# EAGLE design SFT_LIFTUP1.0V (EAGLE 7.5.0)
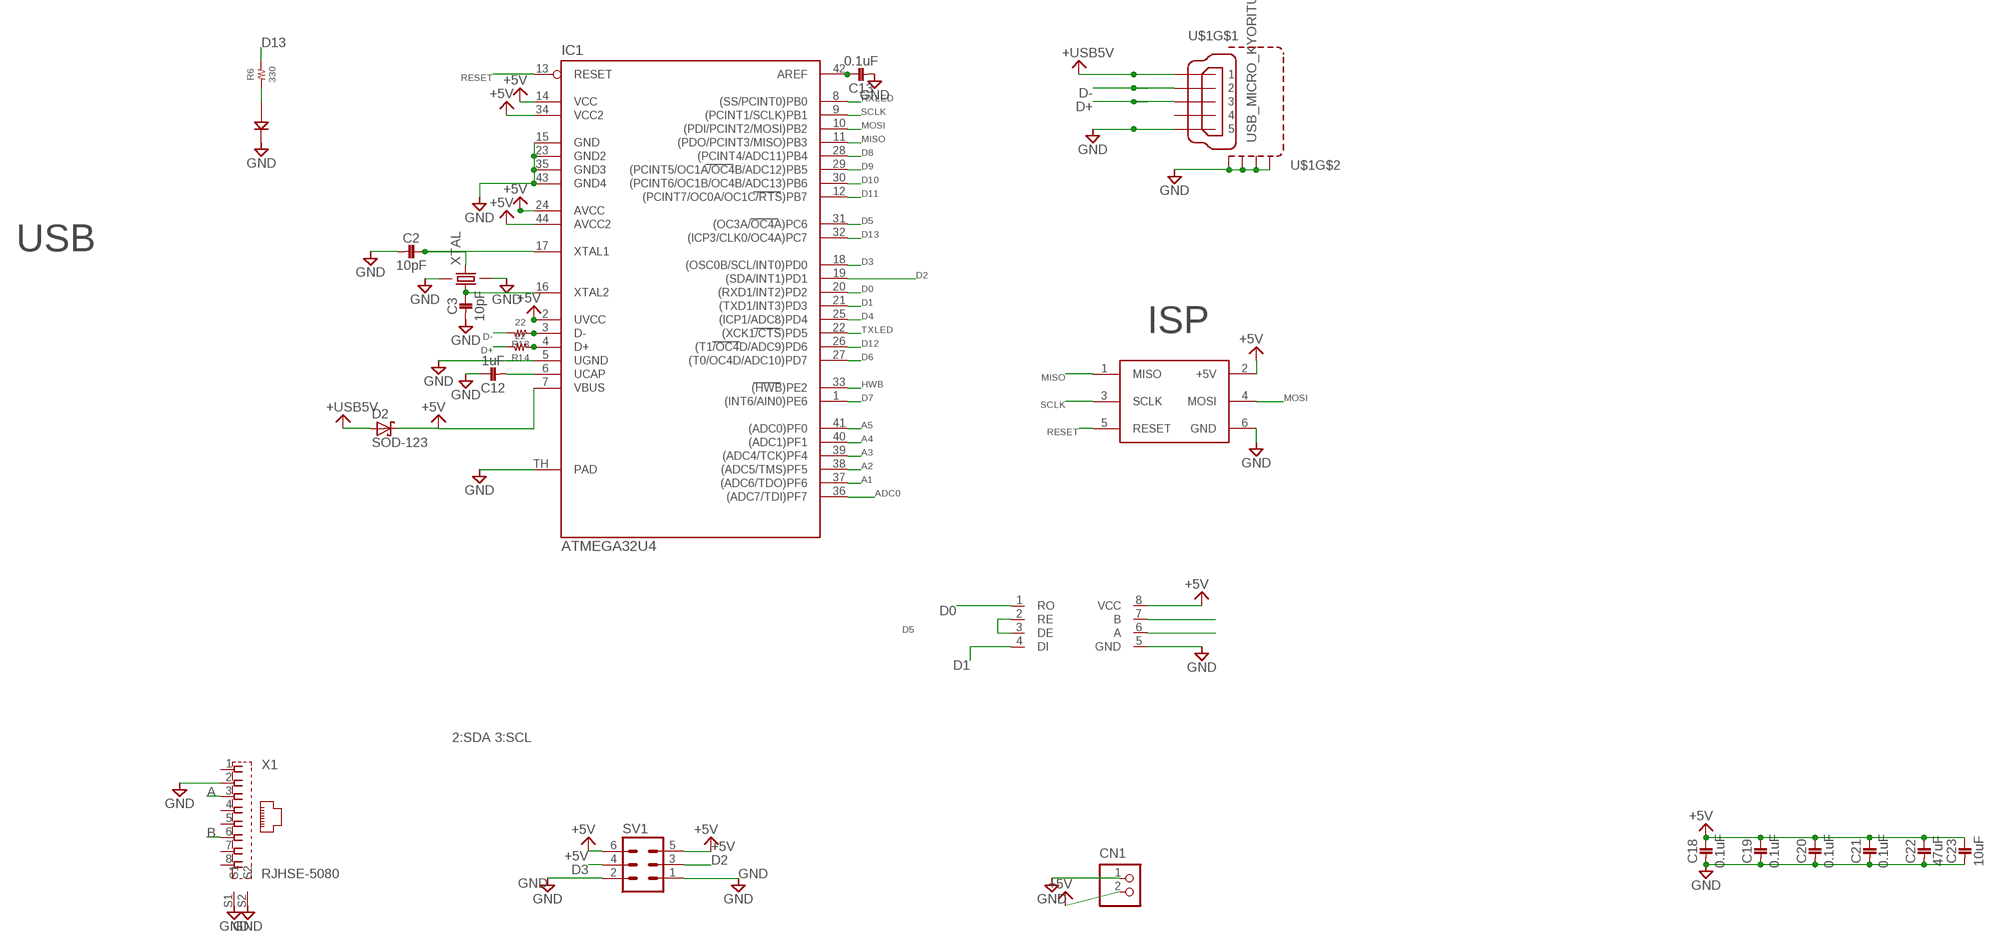
[diagram p0: schematic, sheet 1]

## Parts
C2  10pF  1005  [1005]
C3  10pF  1005  [1005]
C12  1uF  1005  [1005]
C13  0.1uF  1005  [1005]
C18  0.1uF  1005  [1005]
C19  0.1uF  1005  [1005]
C20  0.1uF  1005  [1005]
C21  0.1uF  1005  [1005]
C22  47uF  1608  [1608]
C23  10uF  1608  [1608]
CN1  B2B-XASK-1  [B2B-XASK-1]
D2  SOD-123  [SOD_123]
IC1  ATMEGA32U4  [QFN-44-7X7]
LED1  3MMLED  [3MM]
R6  330  RESISTOR_1005  [1005]
R13  22  RESISTOR_1005  [1005]
R14  22  RESISTOR_1005  [1005]
SV1  ML6  [ML6]
U$1  USB_MICRO_KYORITU  [USB_MICRO_KYORITU]
U$3  ICSP  [ICSP]
U$5  LT1785  [DIL08]
X1  RJHSE-5080  [RJHSE-5080]
XTAL  FA-238  [FA-238]

## Nets
+5V: C18.1 C19.1 C20.1 C21.1 C22.P$1 C23.P$1 CN1.2 D2.C IC1.2(UVCC) IC1.7(VBUS) IC1.14(VCC) IC1.24(AVCC) IC1.34(VCC2) IC1.44(AVCC2) SV1.5 SV1.6 U$3.2(+5V) U$5.8(VCC)
+USB5V: D2.A U$1.1
A: U$5.6(A) X1.3
A1: IC1.37((ADC6/TDO)PF6)
A2: IC1.38((ADC5/TMS)PF5)
A3: IC1.39((ADC4/TCK)PF4)
A4: IC1.40((ADC1)PF1)
A5: IC1.41((ADC0)PF0)
ADC0: IC1.36((ADC7/TDI)PF7)
B: U$5.7(B) X1.6
D0: IC1.20((RXD1/INT2)PD2) U$5.1(RO)
D1: IC1.21((TXD1/INT3)PD3) U$5.4(DI)
D2: IC1.19((SDA/INT1)PD1) SV1.3
D3: IC1.18((OSC0B/SCL/INT0)PD0) SV1.4
D4: IC1.25((ICP1/ADC8)PD4)
D5: IC1.31((OC3A/OC4A)PC6) U$5.2(RE) U$5.3(DE)
D6: IC1.27((T0/OC4D/ADC10)PD7)
D7: IC1.1((INT6/AIN0)PE6)
D8: IC1.28((PCINT4/ADC11)PB4)
D9: IC1.29((PCINT5/OC1A/OC4B/ADC12)PB5)
D10: IC1.30((PCINT6/OC1B/OC4B/ADC13)PB6)
D11: IC1.12((PCINT7/OC0A/OC1C/RTS)PB7)
D12: IC1.26((T1/OC4D/ADC9)PD6)
D13: IC1.32((ICP3/CLK0/OC4A)PC7) R6.2
D+: R14.2 U$1.3
D-: R13.2 U$1.2
GND: C2.2 C3.2 C12.1 C13.2 C18.2 C19.2 C20.2 C21.2 C22.P$2 C23.P$2 CN1.1 IC1.5(UGND) IC1.15(GND) IC1.23(GND2) IC1.35(GND3) IC1.43(GND4) IC1.TH(PAD) LED1.K SV1.1 SV1.2 U$1.5 U$1.M1(S1) U$1.M2(S2) U$1.M3(S3) U$1.M4(S4) U$3.6(GND) U$5.5(GND) X1.2 X1.S1 X1.S2 XTAL.2 XTAL.4
HWB: IC1.33((HWB)PE2)
MISO: IC1.11((PDO/PCINT3/MISO)PB3) U$3.1(MISO)
MOSI: IC1.10((PDI/PCINT2/MOSI)PB2) U$3.4(MOSI)
N$1: LED1.A R6.1
N$7: C3.1 IC1.16(XTAL2) XTAL.1
N$8: IC1.3(D-) R13.1
N$9: C13.1 IC1.42(AREF)
N$10: C2.1 IC1.17(XTAL1) XTAL.3
N$14: IC1.4(D+) R14.1
N$18: C12.2 IC1.6(UCAP)
RESET: IC1.13(RESET) U$3.5(RESET)
RXLED: IC1.8((SS/PCINT0)PB0)
SCLK: IC1.9((PCINT1/SCLK)PB1) U$3.3(SCLK)
TXLED: IC1.22((XCK1/CTS)PD5)
Unconnected: U$1.4 X1.1 X1.4 X1.5 X1.7 X1.8

## Notes on the sheet
- USB
- ISP
- 2:SDA 3:SCL

## Library data of the parts
C2 C3 C12 C13 C18-C21 = 02_C:1005
C22 C23 = 02_C:1608
CN1 = jst-xa:B2B-XASK-1: Wire-to-Board 2.5mm pitch top mount connector Source: http://www.jst-mfg.com/product/pdf/jpn/XA1.pdf http://www.jst-mfg.com/product/detail.php?series=272
D2 = 15_DIODE:SOD-123
IC1 = 04_IC:ATMEGA32U4
LED1 = 10_LED:3MMLED
R6 R13 R14 = 01_R:RESISTOR_1005
SV1 = con-ml:ML6: HARTING; OC_FARNELL: unknown; OC_NEWARK: unknown
U$1 = 08_CONECTOR:USB_MICRO_KYORITU
U$3 = 08_CONECTOR:ICSP
U$5 = 04_IC:LT1785
X1 = rs485:RJHSE-5080: Mod. Jack, Right Angle, 8 posiotion, 8 contatcs RJ45 Source: https://www.amphenolcanada.com/ProductSearch/drawings/AC/RJHSE5080.pdf
XTAL = 09_2_CRYSTAL:FA-238

## Net classes
1 POWER: width 0.5 mm, clearance 0.5 mm

## Board
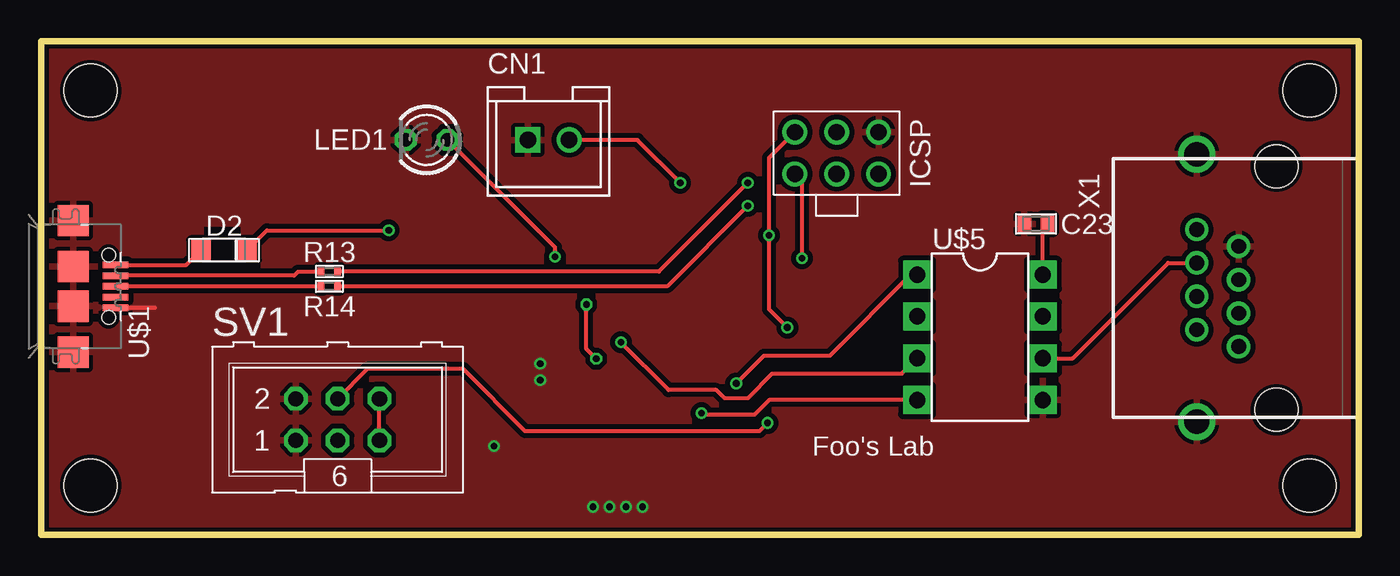
[diagram p1: board, top side]
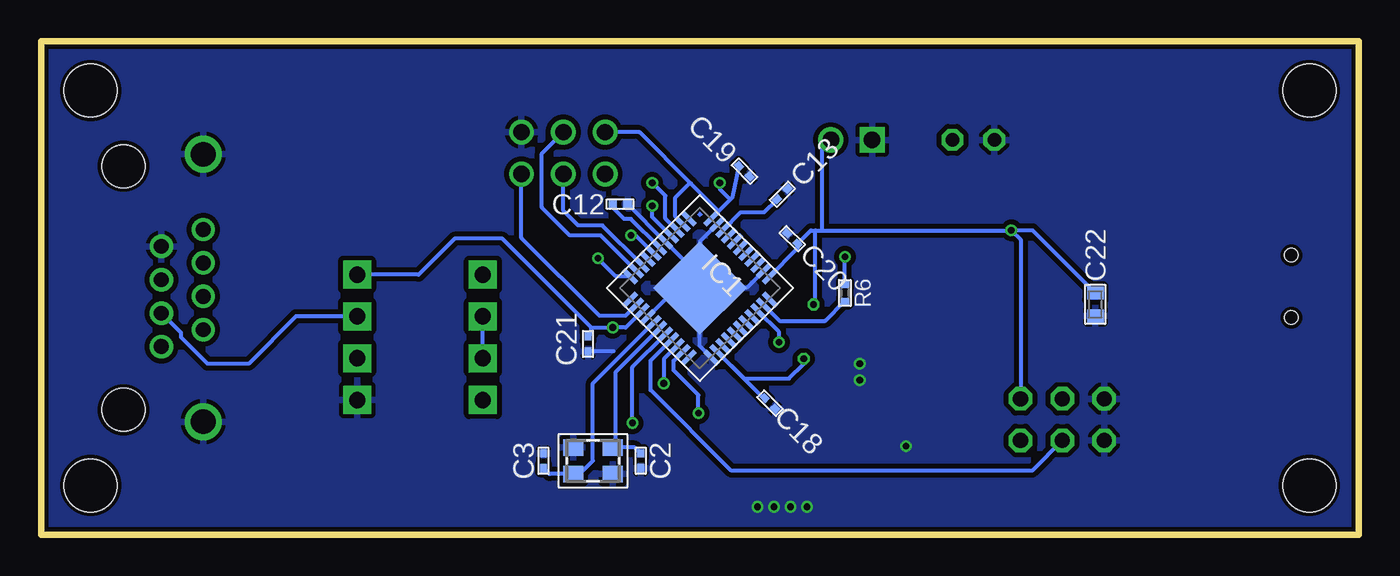
[diagram p2: board, bottom side, seen from below]

Size 80 x 30 mm. Coordinates in mm from the lower left corner, seen from the top.
Outline: 0,0 80,0 80,30 0,30 0,0
Copper layers (1*16): Top 0.035mm / dielectric 1.5mm / Bottom 0.035mm
Design rules "LPKF": minimum track width 6mil, minimum drill 12mil, track to track 0.3mm, track to pad 0.3mm, pad to pad 0.3mm, via to via 0.3mm, smd to smd 0mil, copper to edge 10mil, drill to drill 0.4mm, minimum pad ring 10mil, minimum via ring 6mil, stop-mask expansion 2mil, vias tented up to drill 100mil, thermal gap 10mil
Holes 3.2 mm at 3,27 3,3 77,27 77,3
tRestrict: area 9.9,16 to 12.1,18.7

### Footprints (pad centres in the part's own frame; a part is rotated, then mirrored left to right if it is on the bottom)
1005 = smd 0.5 x 0.4: 1 -0.45,0; 2 0.45,0
1608 = smd 0.8 x 1: P$1 -0.7,0; P$2 0.7,0
B2B-XASK-1 = drill 1.016 square: 1 -1.25,0 | drill 1.016: 2 1.25,0
SOD_123 = smd 1.2 x 1.2: A -1.4,0; C 1.4,0
QFN-44-7X7 = smd 1.1 x 0.3: 1 -3.5,2.5; 2 -3.5,2; 3 -3.5,1.5; 4 -3.5,1; 5 -3.5,0.5; 6 -3.5,0; 7 -3.5,-0.5; 8 -3.5,-1; 9 -3.5,-1.5; 10 -3.5,-2; 11 -3.5,-2.5; 23 3.5,-2.5; 24 3.5,-2; 25 3.5,-1.5; 26 3.5,-1; 27 3.5,-0.5; 28 3.5,0; 29 3.5,0.5; 30 3.5,1; 31 3.5,1.5; 32 3.5,2; 33 3.5,2.5 | smd 0.3 x 1.1: 12 -2.5,-3.5; 13 -2,-3.5; 14 -1.5,-3.5; 15 -1,-3.5; 16 -0.5,-3.5; 17 0,-3.5; 18 0.5,-3.5; 19 1,-3.5; 20 1.5,-3.5; 21 2,-3.5; 22 2.5,-3.5; 34 2.5,3.5; 35 2,3.5; 36 1.5,3.5; 37 1,3.5; 38 0.5,3.5; 39 0,3.5; 40 -0.5,3.5; 41 -1,3.5; 42 -1.5,3.5; 43 -2,3.5; 44 -2.5,3.5 | smd 4 x 4: TH 0,0
3MM = drill 0.813 octagon: A 0,1.27; K 0,-1.27
1005' = smd 0.4 x 0.5: 1 -0.5,0; 2 0.5,0
ML6 = drill 0.914 octagon: 1 -2.54,-1.27; 2 -2.54,1.27; 3 0,-1.27; 4 0,1.27; 5 2.54,-1.27; 6 2.54,1.27
USB_MICRO_KYORITU = smd 0.4 x 1.55: 1 -1.3,-0.775; 2 -0.65,-0.775; 3 0,-0.775; 4 0.65,-0.775; 5 1.3,-0.775 | smd 1.9 x 1.9: M1 4,-3.35; M2 -4,-3.35; M3 -1.2,-3.35; M4 1.2,-3.35 | hole 0.8: -1.9,-1.2; 1.9,-1.2
ICSP = drill 1 pad 1.5: 1 -1.27,2.54; 2 1.27,2.54; 3 -1.27,0; 4 1.27,0; 5 -1.27,-2.54; 6 1.27,-2.54
DIL08 = drill 1 pad 1.7 square: 1 -3.81,-3.81; 2 -1.27,-3.81; 3 1.27,-3.81; 4 3.81,-3.81; 5 3.81,3.81; 6 1.27,3.81; 7 -1.27,3.81; 8 -3.81,3.81
RJHSE-5080 = drill 0.9 pad 1.422: 1 -3.55,-4.84; 2 -2.53,-2.3; 3 -1.52,-4.84; 4 -0.5,-2.3; 5 0.51,-4.84; 6 1.53,-2.3; 7 2.54,-4.84; 8 3.56,-2.3 | drill 1.5: S1 -8.125,-4.84; S2 8.125,-4.84 | hole 2.6: -7.4,0; 7.4,0
FA-238 = smd 1.2 x 1: 1 -1.2,-0.8; 2 1.2,-0.8; 3 1.2,0.8; 4 -1.2,0.8

### Placement (x,y rotation side)
C2  43.6,4.5 270 bottom
C3  49.5,4.5 90 bottom
C12  44.85,20.1 180 bottom
C13  35,20.7 45 bottom
C18  35.75,8 315 bottom
C19  37.3,22.1 315 bottom
C20  34.4,18 135 bottom
C21  46.8,11.6 270 bottom
C22  16,14 270 bottom
C23  60.4,18.9 180 top
CN1  30.8,24 0 top
D2  11.1,17.3 0 top
IC1  40,15 315 bottom
LED1  23.4,24 270 top
R6  330  [1005']  31.2,14.7 270 bottom
R13  22  [1005']  17.5,16 180 top
R14  22  [1005']  17.5,15.1 180 top
SV1  18,7 0 top
U$1  5.3,15.1 270 top
U$3  48.3,23.2 90 top
U$5  57,12 270 top
X1  75,15 270 top
XTAL  46.5,4.5 0 bottom

### Tracks (layer width: path | path; a pad name or v marks a point on that pad's centre or on a via)
+5V  (via drill 0.4)
  Top 0.25: U$5.8 60.81,18.61 C23.P$1 | SV1.5 SV1.6 | U$3.2 44.2,22.91 v44.2,18.2 44.2,13.7 v45.3,12.6 | D2.C 13.7,18.5 v21.1,18.5 | CN1.2 36.2,24 v38.8,21.4 | v33.7,10.7 33.1,11.3 v33.1,14
  Bottom 0.25: U$3.2 43.67,24.47 40.55,21.35 | C18.1 36.15,8.32 IC1.24 37.33,9.5 34.6,9.5 33.7,10.4 v33.7,10.7 | C19.1 38.02,20.52 38.17,20.37 | 39.1,19.44 IC1.44 38.92,19.62 | IC1.7 43.91,18.2 v44.2,18.2 | v21.1,18.5 20.54,17.94 SV1.6 | U$5.8 57.09,15.81 54.9,18 52,18 46.6,12.6 | 32.56,18.5 v21.1,18.5 | C22.P$1 19.8,18.5 v21.1,18.5 | 40.55,21.35 38.92,19.72 38.92,19.62 | 38.17,20.37 38.92,19.62 | 32.56,18.5 32.56,23.49 CN1.2 | IC1.34 34.08,17.38 C20.1 33.26,18.5 33,18.5 | 33,18.5 32.56,18.5 | v33.1,14 33,14.1 33,18.5 | IC1.14 44.52,12.6 v45.3,12.6 46.6,12.6 | IC1.2 41.5,19.33 41.5,20.5 40.65,21.35 40.55,21.35 | v38.8,21.4 38.8,21 38.17,20.37 | C21.1 46.6,12.25 46.6,12.6
+USB5V
  Top 0.25: U$1.1 8.8,16.4 D2.A
A
  Top 0.25: U$5.6 62.63,10.73 68.42,16.52 X1.3
B
  Bottom 0.25: U$5.7 64.53,13.27 67.4,10.4 69.9,10.4 71.5,12 71.5,12.27 X1.6
D0  (via drill 0.4)
  Top 0.25: v42.2,9.2 43.9,10.9 47.9,10.9 52.81,15.81 U$5.1
  Bottom 0.25: IC1.20 42.2,10.68 v42.2,9.2
D1  (via drill 0.4)
  Top 0.25: U$5.4 44.19,8.19 43.3,7.3 40.2,7.3 v40.1,7.4
  Bottom 0.25: IC1.21 41.6,10.57 41.6,10 40.1,8.5 v40.1,7.4
D2
  Bottom 0.25: SV1.3 19.83,3.9 38.1,3.9 43,8.8 43,10.59 IC1.19
D3  (via drill 0.4)
  Top 0.25: SV1.4 19.83,10.1 25.6,10.1 29.4,6.3 43.6,6.3 v44.1,6.8
  Bottom 0.25: IC1.18 44.1,10.19 v44.1,6.8
D5  (via drill 0.4)
  Top 0.25: v35.2,11.7 38.1,8.8 41,8.8 41.5,8.3 42.9,8.3 44.4,9.8 52.26,9.8 U$5.3
  Bottom 0.25: U$5.3 U$5.2 | v35.2,11.7 35.2,12.32 IC1.31
D13
  Bottom 0.25: IC1.32 35.17,13 32.4,13 R6.2
D+
  Top 0.25: R14.2 U$1.3
D-
  Top 0.25: R13.2 15.6,16 15.35,15.75 U$1.2
GND  (via drill 0.4)
  Top 0.25: U$1.5 6.9,13.8
  Bottom 0.25: C12.1 IC1.5 40,15.71 | 45.26,11.15 C21.2 | 40,15.71 IC1.TH | IC1.23 40,11.46 IC1.TH | IC1.15 41.41,15 IC1.TH | IC1.43 40,17.83 40,15.71 | IC1.35 37.17,15 IC1.TH
  other vias: 30.3,10.4 33.5,1.7 27.5,5.4 34.5,1.7 35.5,1.7 36.5,1.7 30.3,9.4
  pour Bottom (rank 6): -10,38 82,38 82,-5 -10,-5
  pour Top: -10,38 82,38 82,-5 -10,-5
MISO  (via drill 0.4)
  Top 0.25: v46.2,16.8 46.2,21.49 U$3.1
  Bottom 0.25: IC1.11 45.11,15.71 v46.2,16.8
MOSI
  Bottom 0.25: IC1.10 46.03,18.2 47.9,18.2 49.6,19.9 49.6,23.17 U$3.4
N$1  (via drill 0.4)
  Top 0.25: v31.2,16.9 31.2,17.47 LED1.A
  Bottom 0.25: R6.1 v31.2,16.9
N$7
  Bottom 0.25: IC1.16 46.5,9.21 46.5,4.5 47.3,3.7 XTAL.1 49.15,3.7 C3.1
N$8  (via drill 0.4)
  Top 0.25: v42.9,21.4 37.5,16 R13.1
  Bottom 0.25: IC1.3 42.1,19.22 42.1,20.6 v42.9,21.4
N$9
  Bottom 0.25: IC1.42 37.52,19.6 36.1,19.6 C13.1
N$10
  Bottom 0.25: IC1.17 45.1,9.9 45.1,5.5 XTAL.3 43.95,5.3 C2.1
N$14  (via drill 0.4)
  Top 0.25: v42.9,20 38,15.1 R14.1
  Bottom 0.25: IC1.4 42.9,19.31 v42.9,20
N$18
  Bottom 0.25: IC1.6 44.2,19.2 44.6,19.2 45.3,19.9 C12.2
RESET
  Bottom 0.25: IC1.13 44.53,13.3 46.1,13.3 50.84,18.04 U$3.5
SCLK
  Bottom 0.25: IC1.9 45.92,18.8 47.4,18.8 48.3,19.7 U$3.3

### Text on the board
tPlace: Foo's Lab
_bPlace: L1
_tNames: C12 | R1 | FN4 | R2 | R13 | IC2 | R14 | C7 | C8 | LED1 | SW2 | R8 | C14 | C16 | C15 | R5 | IC4 | FNP1 | D2 | R17 | R16
_bNames: D1 | C6 | CN1 | C19 | C5 | R18 | C13 | IC3 | R15 | R11 | C23 | FPP | C1 | R3 | IC1 | R6 | C20 | FN1 | C22 | C21 | BLE | R9 | C2 | C3 | C18 | R4